# Altium schematic sheet Audio Controller.SchDoc: Audio Controller
size A4; Organization: Altium Limited; Address1: L3, 12a Rodborough Rd; Address2: Frenchs Forest; Address3: NSW; Address4: Australia 2086; Revision: 1; SheetNumber: 6; SheetTotal: 11; Alumno: Diego Caceres; Curso: R1051; Materia: Sistemas de Representación; Docentes: Ing. Perdomo, Ing. Fuoco, Ing. Giorno, Sr. Vergili
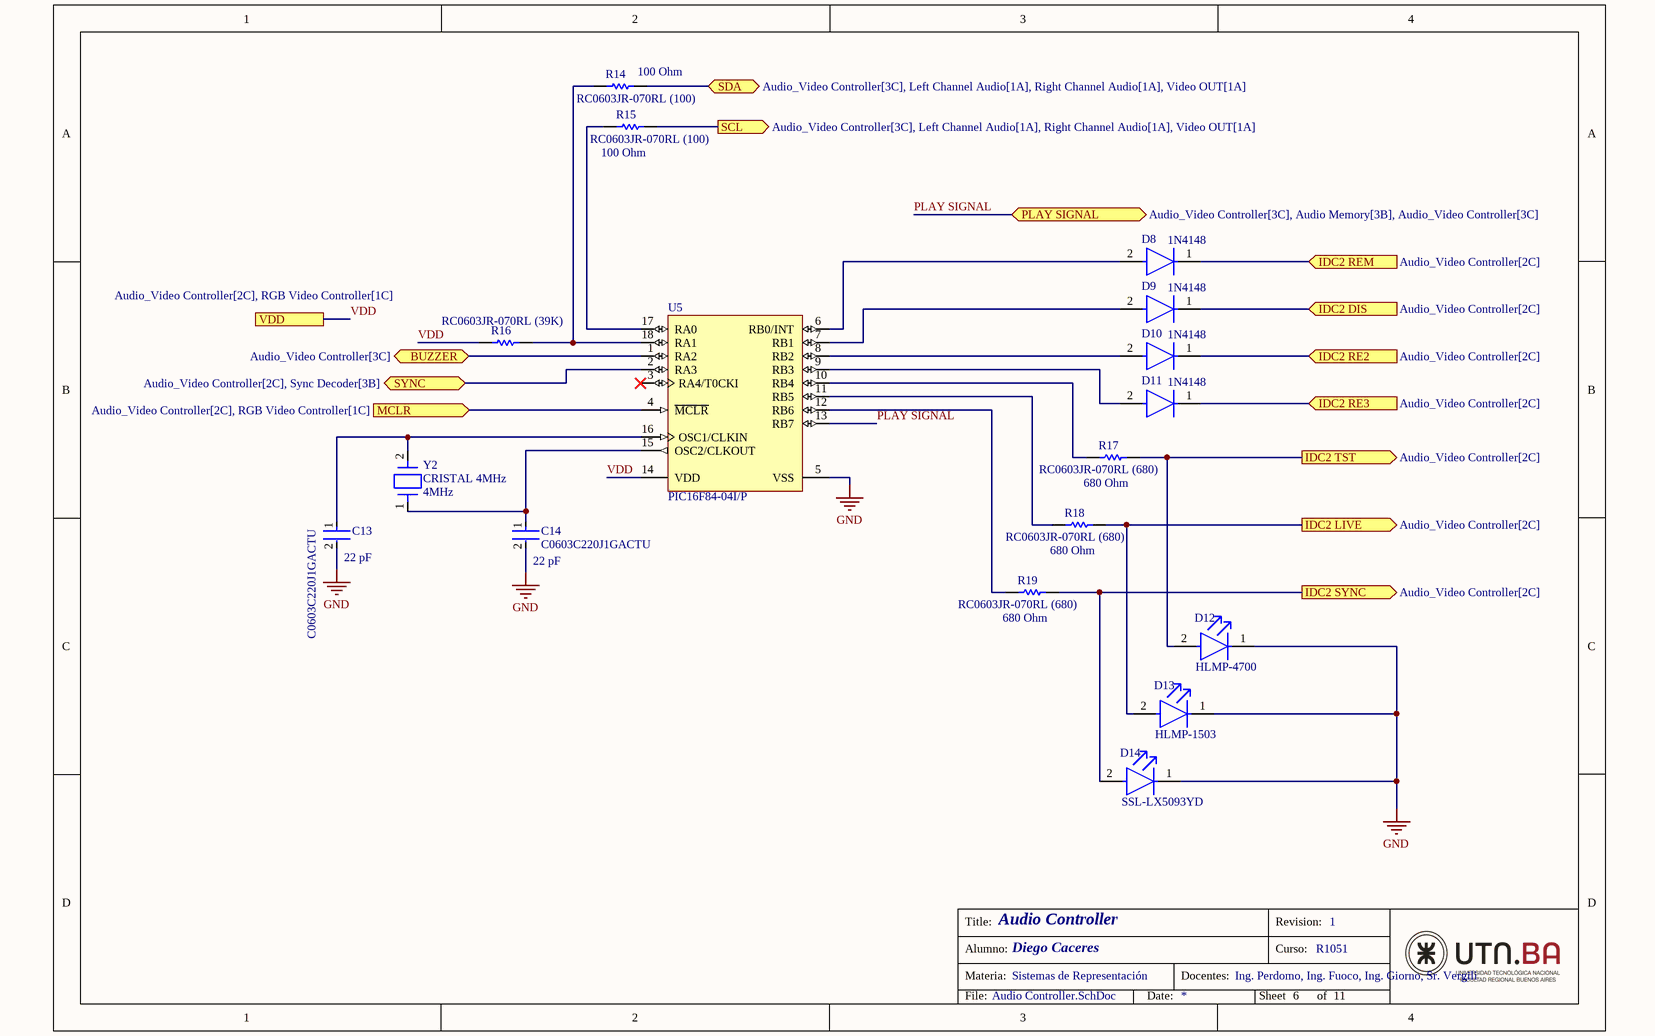
[diagram p0: Audio Controller.SchDoc]

## Parts
C13  C0603C220J1GACTU  Capacitance: 22 pF  [FP-C0603C-CF-MFG]
C14  C0603C220J1GACTU  value 22 pF  [FP-C0603C-CF-MFG]
D8  1N4148  [FP-017AG-MFG]
D9  1N4148  [FP-017AG-MFG]
D10  1N4148  [FP-017AG-MFG]
D11  1N4148  [FP-017AG-MFG]
D12  HLMP-4700  [FP-HLMP-4700-MFG]
D13  HLMP-1503  [FP-HLMP-1503-MFG]
D14  SSL-LX5093YD  [FP-SSL-LX5093YD-MFG]
R14  RC0603JR-070RL (100)  Resistance: 100 Ohm  [RESC1608X55X25ML10T15]
R15  RC0603JR-070RL (100)  Resistance: 100 Ohm  [RESC1608X55X25ML10T15]
R16  RC0603JR-070RL (39K)  [RESC1608X55X25ML10T15]
R17  RC0603JR-070RL (680)  Resistance: 680 Ohm  [RESC1608X55X25ML10T15]
R18  RC0603JR-070RL (680)  Resistance: 680 Ohm  [RESC1608X55X25ML10T15]
R19  RC0603JR-070RL (680)  Resistance: 680 Ohm  [RESC1608X55X25ML10T15]
U5  PIC16F84-04I/P  [MCHP-PDIP-P18]
Y2  CRISTAL 4MHz  Frequency: 4MHz  [HC-49/US_SMD_CRISTAL 4MHz_DCACERES]

## Ports
BUZZER (bidir, see Audio_Video Controller[3C]), IDC2 DIS (in, see Audio_Video Controller[2C]), IDC2 LIVE (out, see Audio_Video Controller[2C]), IDC2 RE2 (in, see Audio_Video Controller[2C]), IDC2 RE3 (in, see Audio_Video Controller[2C]), IDC2 REM (in, see Audio_Video Controller[2C]), IDC2 SYNC (out, see Audio_Video Controller[2C]), IDC2 TST (out, see Audio_Video Controller[2C]), MCLR (in, see Audio_Video Controller[2C], RGB Video Controller[1C]), PLAY SIGNAL (bidir, see Audio_Video Controller[3C], Audio Memory[3B], Audio_Video Controller[3C]), SCL (out, see Audio_Video Controller[3C], Left Channel Audio[1A], Right Channel Audio[1A], Video OUT[1A]), SDA (bidir, see Audio_Video Controller[3C], Left Channel Audio[1A], Right Channel Audio[1A], Video OUT[1A]), SYNC (bidir, see Audio_Video Controller[2C], Sync Decoder[3B]), VDD (see Audio_Video Controller[2C], RGB Video Controller[1C])

## Nets
GND: C13.2 C14.2 D12.1(C) D13.1(C) D14.1(C) U5.5(VSS)
BUZZER: U5.1(RA2) ; port BUZZER
IDC2 DIS: D9.1(C) ; port IDC2 DIS
IDC2 LIVE: D13.2(A) R18.1 ; port IDC2 LIVE
IDC2 RE2: D10.1(C) ; port IDC2 RE2
IDC2 RE3: D11.1(C) ; port IDC2 RE3
IDC2 REM: D8.1(C) ; port IDC2 REM
IDC2 SYNC: D14.2(A) R19.1 ; port IDC2 SYNC
IDC2 TST: D12.2(A) R17.1 ; port IDC2 TST
MCLR: U5.4(~{MCLR}) ; port MCLR
PLAY SIGNAL: U5.13(RB7) ; port PLAY SIGNAL
SCL: R15.1 ; port SCL
SDA: R14.1 ; port SDA
SYNC: U5.2(RA3) ; port SYNC
VDD: R16.2 U5.14(VDD) ; port VDD
NetC13_1: C13.1 U5.16(OSC1/CLKIN) Y2.2
NetC14_1: C14.1 U5.15(OSC2/CLKOUT) Y2.1
NetD8_2: D8.2(A) U5.6(RB0/INT)
NetD9_2: D9.2(A) U5.7(RB1)
NetD10_2: D10.2(A) U5.8(RB2)
NetD11_2: D11.2(A) U5.9(RB3)
NetR14_2: R14.2 R16.1 U5.18(RA1)
NetR15_2: R15.2 U5.17(RA0)
NetR17_2: R17.2 U5.10(RB4)
NetR18_2: R18.2 U5.11(RB5)
NetR19_2: R19.2 U5.12(RB6)

Not connected (* = marked no-connect by the designer): U5 3(RA4/T0CKI)*

## Notes on the sheet
- Title:
- Revision:
- Alumno:
- Materia:
- Docentes:
- Curso:
- File:
- Date:
- Sheet
- of

## Library data of the parts
C13 C14 = CMP-2006-03322-2: CAP CER 22PF 100V 5% NP0 0603; Manufacturer: KEMET; Material: Ceramic; Automotive Grade: Grade 1; Temperature Characteristic: C0G; Temperature Coefficient: 30ppm/°C; Tolerance: 0.05; Temperature Range High: +125°C; ComponentLink2URL: https://api.kemet.com/component-edge/download/datasheet/C0603C100J5GACAUTO.pdf; Package: C0603C-CF; Category: Cap; Voltage Rating: 100 V; Automotive: Yes; Mouser Description: Multilayer Ceramic Capacitors MLCC - SMD/SMT 100volts 22pF C0G 5%; Device Class L1: Passive Components; Device Class L3: Ceramic Capacitors; Temperature: -55°C to +125°C; Digikey Description: CAP CER 22PF 100V 5% NP0 0603; RoHS: TRUE; ComponentLink2Description: Datasheet; Height: 0.87mm; Temperature Range Low: -55°C; Manufacturer Part Number: C0603C220J1GACTU; Device Class L2: Capacitors; Octopart: https://octopart.com/c0603c220j1gactu-kemet-9142653; Lead Free: Yes
  C13: Value: 22 pF
  C14: Capacitance: 22 pF
D8-D11 = CMP-07163-000046-1: DIODE GEN PURP 100V 200MA DO35; Forward Voltage: 1V; Max Power Dissipation: 500mW; Max Reverse Current: 5uA; Forward Current: 300mA; Current: 4A; Reverse Recovery Time: 4ns; Element Configuration: Single; Outside Diameter: 1.85mm; Capacitance: 4pF; Polarity: Standard; Max Forward Surge Current (Ifsm): 1A; Reverse Voltage: 100V; Output Current: 200mA; Average Rectified Current: 200mA; Diameter: 1.91mm; Max Repetitive Reverse Voltage (Vrrm): 100V; Current Rating: 200mA; Case/Package: DO-35; Lead Free: Lead Free; Number of Pins: 2; Recovery Time: 4ns; Packaging: Bulk; Contact Plating: Tin; Voltage: 100V; Mount: Through Hole; Max Surge Current: 4A; Package Quantity: 2000; Width: 1.91mm; Max Reverse Voltage (DC): 100V; Length: 4.56mm; Radiation Hardening: No; Power Dissipation: 500mW; Voltage Rating (DC): 100V; Peak Non-Repetitive Surge Current: 4A; REACH SVHC: No SVHC; Height: 4.56mm; Max Operating Temperature: 175°C; Series: -; Weight: 0.01lb; Min Operating Temperature: -65°C
D12 = CMP-18399-000008-1: LED RED DIFFUSED T-1 3/4 T/H; Manufacturer: Broadcom; Luminous Intensity: 2.3mcd; Peak Emmision Wavelength: 635nm; Forward Voltage: 1.7V; Viewing Angle: 50°; Led Orientation: Straight; Reverse Voltage: 5V; Forward Current: 2mA; Power Dissipation: 14mW; Wavelength: 626nm; Digikey Description: LED RED DIFFUSED T-1 3/4 T/H; Device Class L3: unset; Temperature Range Low: -40°C; Temperature Range High: +100°C; RoHS: TRUE; Package: HLMP-4700; Octopart: https://octopart.com/hlmp-4700-broadcom-71130526; Automotive: No; ComponentLink2URL: https://docs.broadcom.com/docs/AV02-1557EN; Colour: Red; Temperature: -40°C to +100°C; Lead Free: Yes; Category: Diode; ComponentLink2Description: Datasheet; Manufacturer Part Number: HLMP-4700; Device Class L1: Optoelectronics; Device Class L2: LEDs; Mouser Description: LED; Red; 2.3mcd; 0.24In.Dia.; T-1-3/4; 500mA; 1.7V; 635nm; 50deg; 5V; 24mW; -55degC;
D13 = CMP-18399-000010-1: LED GREEN DIFFUSED T-1 T/H; Manufacturer: Broadcom; Reverse Voltage: 5V; Wavelength: 569nm; Forward Voltage: 2.1V; Led Orientation: Straight; Viewing Angle: 60°; Max Junction Temp: +110°C; Peak Emmision Wavelength: 565nm; Luminous Intensity: 1mcd; Standoff Height: 0.88mm; Forward Current: 10mA; Mouser Description: LED; Green; 1mcd; 0.115In.Dia.; T-1; 565nm; 25mA; 2.1V; 5V; GaP; -20degC; 100deg; ComponentLink2Description: Datasheet; Digikey Description: LED GREEN DIFFUSED T-1 T/H; Device Class L1: Optoelectronics; Device Class L3: unset; Automotive: No; Device Class L2: LEDs; Manufacturer Part Number: HLMP-1503; Category: Diode; Temperature Range Low: -20°C; Height: 6.35mm; RoHS: TRUE; Octopart: https://octopart.com/hlmp-1503-broadcom-71130371; Temperature: -20°C to +100°C; Lead Free: Yes; ComponentLink2URL: https://docs.broadcom.com/docs/AV02-1555EN; Package: HLMP-1503; Colour: Green; Temperature Range High: +100°C
D14 = CMP-57192-000007-1: LED YELLOW DIFFUSED T-1 3/4 T/H; Test Current: 20mA; Number of LEDs: 1; Dominant Wavelength: 568nm; Wavelength: 585nm; Forward Voltage: 2.1V; Lens Style: Dome; Viewing Angle: 60°; Luminous Intensity: 30mcd; Min Operating Temperature: -40°C; Packaging: Bulk; Width: 1.5inch; Lead Free: Lead Free; Number of Pins: 2; Color: Yellow; Case/Package: Radial; Forward Current: 20mA; REACH SVHC: No SVHC; Lens Transparency: Diffused; Weight: 0.01lb; Height: 8.6mm; Package Quantity: 1000; Series: -; Length: 0.5inch; Illumination Color: Yellow; Mount: Through Hole; Diameter: 5mm; RoHS Compliant: Yes; Lens Color: Yellow; Max Operating Temperature: 85°C
R14 R15 R17-R19 = CMP-2100-03667-1: Chip Resistor, 0 Ohm, +/- 5%, 0.1 W, -55 to 155 degC, 0603 (1608 Metric), RoHS, Tape and Reel; Manufacturer: Yageo; Temperature Coefficient: 200ppm/degreesC; Voltage Rating: 50V; Power Rating: 100mW; Width: 0.8mm; Max Operating Temperature: 155degC; Tolerance: 5%; Package Reference: 0603; Height: 0.45mm; Depth: 0.8mm; Package Description: 2-Pin Surface Mount Device, Body 1.6 x 0.8 mm; Termination: SMD/SMT; Package Quantity: 5000; Case/Package: 0603; Case Code (Imperial): 0603; Radiation Hardening: No; Number of Pins: 2; Length: 1.6mm; Lead Free: LeadFree; Voltage Rating (DC): 50V; Military Standard: Not; Datasheet URL: http://www.yageo.com/NewPortal/yageodocoutput?fileName=/pdf/R-Chip/PYu-RC_Group_51_RoHS_L_5.pdf; Manufacturer URL: http://www.yageo.com/; Packaging: TapeandReel; Case Code (Metric): 1608; Min Operating Temperature: -55degC; Composition: ThickFilm; RoHSCompliant: true; Contact Plating: Tin; Datasheet Version: Rev. 5, 10/2016; REACH SVHC: NoSVHC
R16 = CMP-2100-03667-1: Chip Resistor, 0 Ohm, +/- 5%, 0.1 W, -55 to 155 degC, 0603 (1608 Metric), RoHS, Tape and Reel; Manufacturer: Yageo; Temperature Coefficient: 200ppm/degreesC; Voltage Rating: 50V; Power Rating: 100mW; Resistance: 0mOhm; Width: 0.8mm; Max Operating Temperature: 155degC; Tolerance: 5%; Package Reference: 0603; Height: 0.45mm; Depth: 0.8mm; Package Description: 2-Pin Surface Mount Device, Body 1.6 x 0.8 mm; Termination: SMD/SMT; Package Quantity: 5000; Case/Package: 0603; Case Code (Imperial): 0603; Radiation Hardening: No; Number of Pins: 2; Length: 1.6mm; Lead Free: LeadFree; Voltage Rating (DC): 50V; Military Standard: Not; Datasheet URL: http://www.yageo.com/NewPortal/yageodocoutput?fileName=/pdf/R-Chip/PYu-RC_Group_51_RoHS_L_5.pdf; Manufacturer URL: http://www.yageo.com/; Packaging: TapeandReel; Case Code (Metric): 1608; Min Operating Temperature: -55degC; Composition: ThickFilm; RoHSCompliant: true; Contact Plating: Tin; Datasheet Version: Rev. 5, 10/2016; REACH SVHC: NoSVHC
U5 = CMP-0115-01671-1: Flash / EEPROM 8-Bit Microcontroller, 4 MHz, 13 I/O, -40 to 85 degC, 18-pin PDIP (P18), Tube; Manufacturer: Microchip; I/O Pins: 13; Digital Communication: 0 -UART, 0 -A/E/USART, 0 -SPI, 0 -I2C, 0 -MSSP(SPI/I2C), 0 -SSP(SPI/I2C); Operation Voltage Range: 4V - 6V; RAM: 68; EEPROM Data Memory (bytes): 64; Program Memory KBytes: 1.75; Program Memory KWords: 1; Timers: 1 - 8-bit; Max. CPU Speed MHz: 4; ComponentLink2URL: http://www.microchip.com/stellent/groups/techpub_sg/documents/packagingspec/en012702.pdf; ComponentLink1Description: Datasheet; ComponentLink3URL: Product URL:http://www.microchip.com/datasheet/PIC16F84; ComponentLink3Description: URL Link1; ComponentLink2Description: Package Specification; ComponentLink1URL: http://ww1.microchip.com/downloads/en/DeviceDoc/30430D.pdf; Packing: TUBE; PackageDescription: 18-Lead Plastic Dual In-Line, Row Spacing 7.62 mm, 22.86 x 6.6 mm Body, 2.54 mm Pitch; Mounting Technology: Through Hole; Memory Type: Flash; RoHS: TRUE; PackageVersion: C04-007B, 12/2012; PartNumber: PIC16F84-04I/P; PackageReference: PDIP-P18; DatasheetVersion: Rev. D
Y2 = Cristal_4MHz_Caceres: Cristal SMD 4.00MHz; PartNumber: ABLS-4.000MHZ-K4T; Manufacturer: Abracon; ComponentLink1Description: Datasheet; ComponentLink1URL: https://www.mouser.com/datasheet/2/3/abls-1664338.pdf; Package: HC-49/US; TerminalForm: SMD; Series: ABLS; ComponentLink2Description: URL Link1; ComponentLink2URL: https://www.mouser.com/ProductDetail/ABRACON/ABLS-4.000MHZ-K4T?qs=uDmhV2jwPRfEVDsdVpSQ5A%3D%3D; ComponentLink3Description: URL Link2; ComponentLink3URL: https://www.digikey.com/en/products/detail/abracon-llc/ABLS-4-000MHZ-K4T/2001297